# Altium project AD转化量化器.PrjPCB
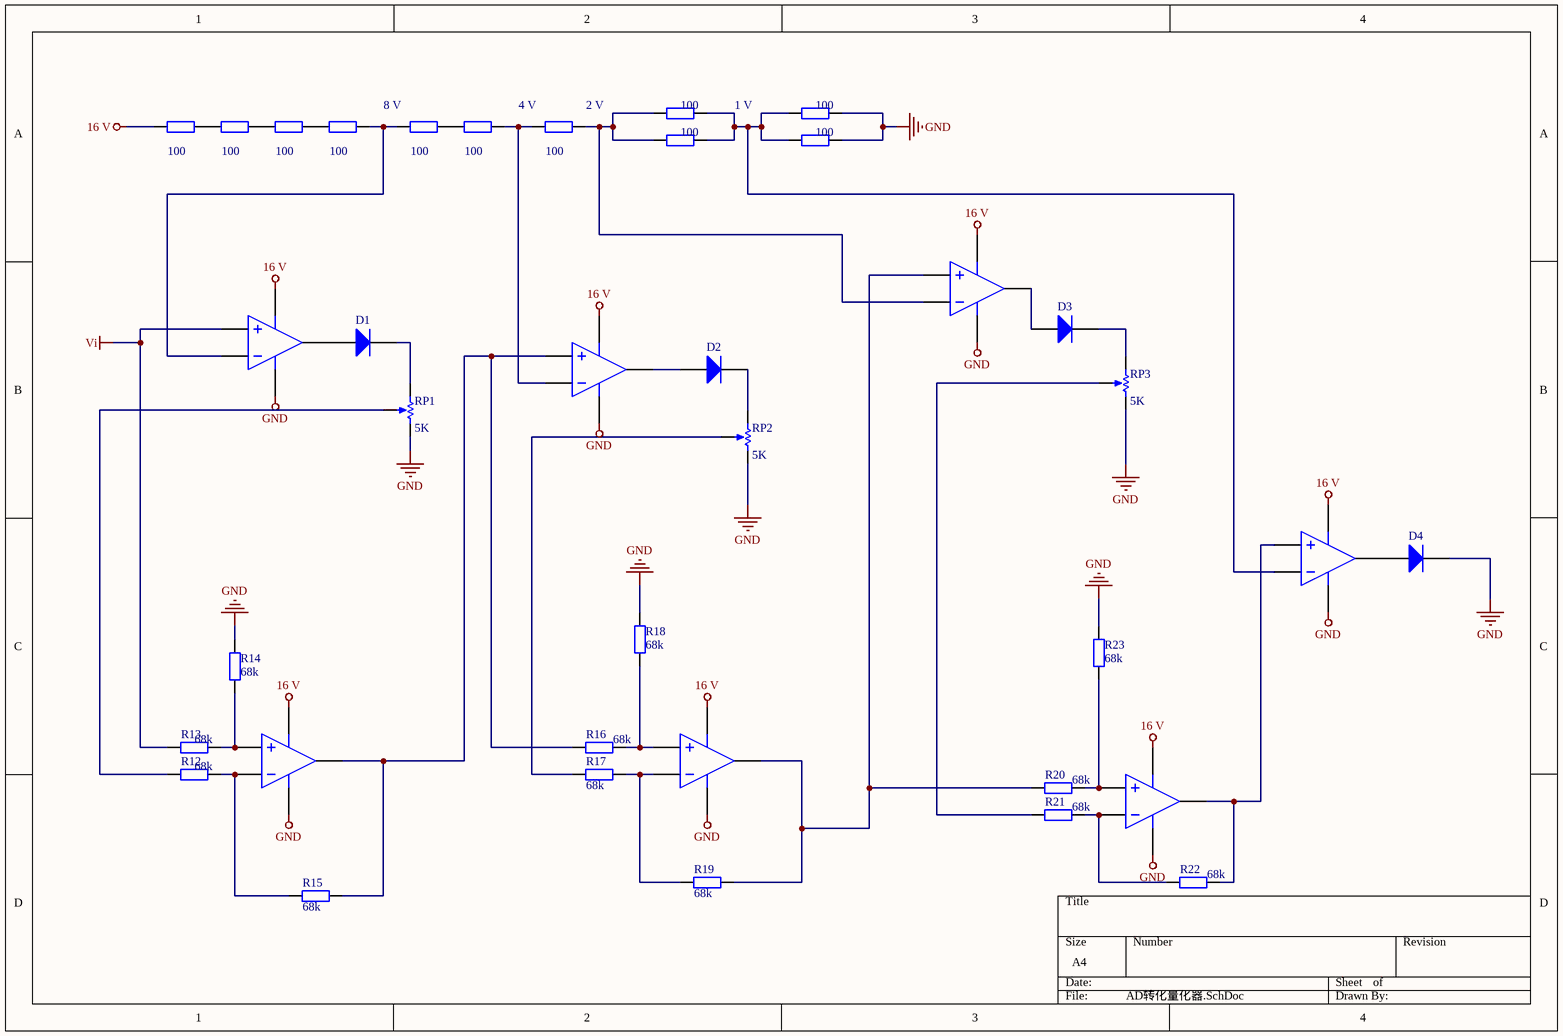
[diagram p0: AD转化量化器.SchDoc]
1 sheet, 32 parts. Net scope: global (net labels, ports and power ports of the same name join across sheets).
Board file: AD转化量化器.PcbDoc

## Sheet AD转化量化器.SchDoc
size A4

### Parts
D1  Diode 1N914  [DO-35]  (value not drawn)
D2  Diode 1N914  [DO-35]  (value not drawn)
D3  Diode 1N914  [DO-35]  (value not drawn)
D4  Diode 1N914  [DO-35]  (value not drawn)
R1  value 100  [AXIAL-0.4]  (hidden comment: Res2)
R2  value 100  [AXIAL-0.4]  (hidden comment: Res2)
R3  value 100  [AXIAL-0.4]  (hidden comment: Res2)
R4  value 100  [AXIAL-0.4]  (hidden comment: Res2)
R5  value 100  [AXIAL-0.4]  (hidden comment: Res2)
R6  value 100  [AXIAL-0.4]  (hidden comment: Res2)
R7  value 100  [AXIAL-0.4]  (hidden comment: Res2)
R8  value 100  [AXIAL-0.4]  (hidden comment: Res2)
R9  value 100  [AXIAL-0.4]  (hidden comment: Res2)
R10  value 100  [AXIAL-0.4]  (hidden comment: Res2)
R11  value 100  [AXIAL-0.4]  (hidden comment: Res2)
R12  value 68k  [AXIAL-0.4]  (hidden comment: Res2)
R13  value 68k  [AXIAL-0.4]  (hidden comment: Res2)
R14  value 68k  [AXIAL-0.4]  (hidden comment: Res2)
R15  value 68k  [AXIAL-0.4]  (hidden comment: Res2)
R16  value 68k  [AXIAL-0.4]  (hidden comment: Res2)
R17  value 68k  [AXIAL-0.4]  (hidden comment: Res2)
R18  value 68k  [AXIAL-0.4]  (hidden comment: Res2)
R19  value 68k  [AXIAL-0.4]  (hidden comment: Res2)
R20  value 68k  [AXIAL-0.4]  (hidden comment: Res2)
R21  value 68k  [AXIAL-0.4]  (hidden comment: Res2)
R22  value 68k  [AXIAL-0.4]  (hidden comment: Res2)
R23  value 68k  [AXIAL-0.4]  (hidden comment: Res2)
RP1  value 5K  [VR5]  (hidden comment: RPot)
RP2  value 5K  [VR5]  (hidden comment: RPot)
RP3  value 5K  [VR5]  (hidden comment: RPot)
U1  LM324AN  [N14A]  (value not drawn)  (parts A,B,C,D of 4)
U2  LM324AN  [N14A]  (value not drawn)  (parts A,B,D of 4)

### Nets
16 V: R1.1 U1.11(GND) U2.11(GND)
GND: D4.2(K) R10.2 R11.2 R14.2 R18.1 R23.2 RP1.2(BOT) RP2.2(BOT) RP3.2(BOT) U1.4(V+) U2.4(V+)
Vi: R13.1 U1.3(IN1+)
NetD1_1: D1.1(A) U1.1(OUT1)
NetD1_2: D1.2(K) RP1.1(TOP)
NetD2_1: D2.1(A) U1.14(OUT4)
NetD2_2: D2.2(K) RP2.1(TOP)
NetD3_1: D3.1(A) U2.1(OUT1)
NetD3_2: D3.2(K) RP3.1(TOP)
NetD4_1: D4.1(A) U2.14(OUT4)
NetR1_2: R1.2 R2.1
NetR2_2: R2.2 R3.1
NetR3_2: R3.2 R4.1
NetR4_2: R4.2 R5.1 U1.2(IN1-)
NetR5_2: R5.2 R6.1
NetR6_2: R6.2 R7.1 U1.13(IN4-)
NetR7_2: R7.2 R8.1 R9.1 U2.2(IN1-)
NetR8_2: R8.2 R9.2 R10.1 R11.1 U2.13(IN4-)
NetR12_1: R12.1 RP1.3(TAP)
NetR12_2: R12.2 R15.2 U1.6(IN2-)
NetR13_2: R13.2 R14.1 U1.5(IN2+)
NetR15_1: R15.1 R16.2 U1.7(OUT2) U1.12(IN4+)
NetR16_1: R16.1 R18.2 U1.10(IN3+)
NetR17_1: R17.1 R19.1 U1.9(IN3-)
NetR17_2: R17.2 RP2.3(TAP)
NetR19_2: R19.2 R20.1 U1.8(OUT3) U2.3(IN1+)
NetR20_2: R20.2 R23.1 U2.5(IN2+)
NetR21_1: R21.1 RP3.3(TAP)
NetR21_2: R21.2 R22.1 U2.6(IN2-)
NetR22_2: R22.2 U2.7(OUT2) U2.12(IN4+)

### Notes on the sheet
- (near R5) 8 V
- (near R7) 4 V
- (near R7) 2 V
- 1 V

### Library data of the parts
D1-D4 = Diode 1N914: High Conductance Fast Diode; Published: 8-Jun-2000; LatestRevisionDate: 17-Jul-2002; LatestRevisionNote: Re-released for DXP Platform.; DatasheetVersion: 1997; PackageReference: DO-35; Publisher: Altium Limited; PackageDescription: Diode, Axial; Body 3.8 x 1.9 mm (LxDia. max), Lead Dia. 0.53 mm (max); Code_JEDEC: DO-204-AH; ComponentLink1Description: Manufacturer Link; ComponentLink1URL: http://www.fairchildsemi.com/; ComponentLink2Description: Datasheet; ComponentLink2URL: http://www.fairchildsemi.com/ds/1N%2F1N4448.pdf
R1-R23 = Res2: Resistor; Published: 8-Jun-2000; LatestRevisionDate: 17-Jul-2002; LatestRevisionNote: Re-released for DXP Platform.; PackageReference: AXIAL-0.4; Publisher: Altium Limited; PackageDescription: Axial Device, Thru-Hole; 2 Leads; 0.4 in Pin Spacing
RP1-RP3 = RPot: Potentiometer; Sim Note: Enter the Resistance value and the set point into parameter fields.; Set Position: 0.5; Published: 8-Jun-2000; LatestRevisionDate: 17-Jul-2002; LatestRevisionNote: Re-released for DXP Platform.; PackageReference: VR5; Publisher: Altium Limited; PackageDescription: Variable Resistor, Thru-Hole; 3 Leads
U1 U2 = LM324AN: Low Power Quad Operational Amplifier, 14-pin MDIP; Manufacturer: National Semiconductor; PackageTopMarking: NSUZXYYTTE#*LM324AN; PowerWise: N; CompType: Amplifiers; Published: 4-Dec-2008; LatestRevisionDate: 13-Jan-2009; LatestRevisionNote: Sim Model Added.; DatasheetVersion: Aug-2000; PackageVersion: revG, May-2006; PackageReference: N14A; Publisher: Altium Limited; PackageDescription: MDIP, .750 x .250 x.130in, 14 Lead, .100in Pitch; Supplier 1: Farnell; Supplier Part Number 1: 9486917; PartNumber: LM324AN; RoHS: N; PinCount: 14; Code_JEDEC: MS-001-AA; ComponentLink1Description: LM324 Datasheet; ComponentLink1URL: http://www.national.com/ds/LM/LM324.pdf; ComponentLink2Description: LM324 Web Page; ComponentLink2URL: http://www.national.com/pf/LM/LM324.html; ComponentLink3Description: N14A Package Page; ComponentLink3URL: http://www.national.com/packaging/folders/n14a.html